# Altium project FMU3_REV_G.PrjPcb
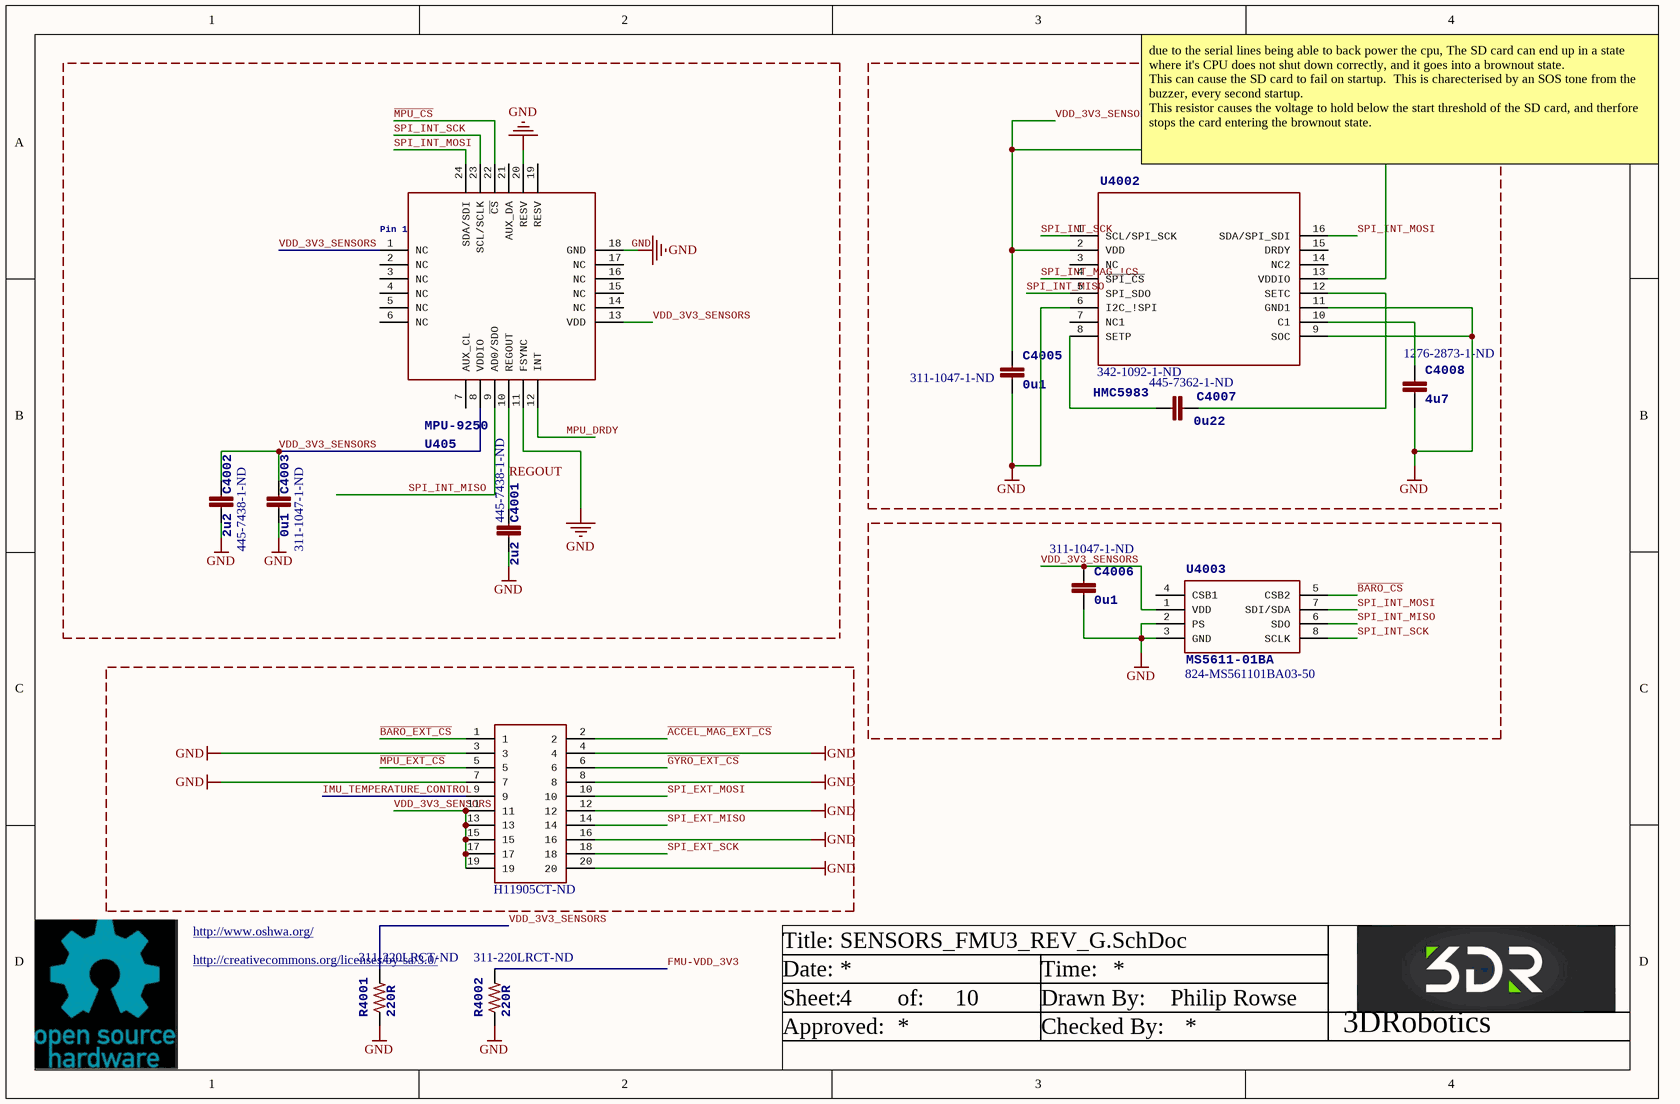
[diagram p0: SENSORS_FMU3_REV_G.SchDoc]
2 sheets, 25 parts. Net scope: global (net labels, ports and power ports of the same name join across sheets).
Board file: FMU3_REV_G.PcbDoc
Sheets:
  SENSORS_FMU3_REV_G.SchDoc
  PWM_PPM_FMU3_REV_G.SchDoc

## Sheet SENSORS_FMU3_REV_G.SchDoc: Pixhawk_mini_8L.sch
size A4; Date: 18/08/2014 1:53:16 PM; DrawnBy: Philip Rowse; SheetNumber: 4; SheetTotal: 10

### Parts
C4001  2u2  Supplier Part Number 1: 445-7438-1-ND  [0603-CAP]
C4002  2u2  Supplier Part Number 1: 445-7438-1-ND  [0603-CAP]
C4003  0u1  Supplier Part Number 1: 311-1047-1-ND  [0402-CAP]
C4005  0u1  Supplier Part Number 1: 311-1047-1-ND  [0402-CAP]
C4006  0u1  Supplier Part Number 1: 311-1047-1-ND  [0402-CAP]
C4007  0u22  Supplier Part Number 1: 445-7362-1-ND  [0402-CAP]
C4008  4u7  Supplier Part Number 1: 1276-2873-1-ND  [0805]
R4001  220R  Supplier Part Number 1: 311-220LRCT-ND  [0402-RES]
R4002  220R  Supplier Part Number 1: 311-220LRCT-ND  [0402-RES]
U405  MPU-9250  [MPU-9250]
U4002  HMC5983  Supplier Part Number 1: 342-1092-1-ND  [HMC5983-new]
U4003  MS5611-01BA  Supplier Part Number 1: 824-MS561101BA03-50  [MS5611-01BA]
U$2  Supplier Part Number 1: H11905CT-ND  [DF-40C-20DS]  (hidden comment: DF40C-20-DS)

### Nets
GND: C4001.P$2 C4002.P$2 C4003.P$2 C4005.P$2 C4006.P$2 C4008.2 R4001.P$1 R4002.P$1 U405.11(FSYNC) U405.18(GND) U405.20(RESV) U4002.6(I2C_!SPI) U4002.9(SOC) U4002.11(GND1) U4003.2(PS) U4003.3(GND) U$2.3 U$2.4 U$2.7 U$2.8 U$2.12 U$2.16 U$2.20
~{ACCEL_MAG_EXT_CS}: U$2.2
~{BARO_CS}: U4003.5(CSB2)
~{BARO_EXT_CS}: U$2.1
FMU-VDD_3V3: R4002.P$2
~{GYRO_EXT_CS}: U$2.6
IMU_TEMPERATURE_CONTROL: U$2.9
~{MPU_CS}: U405.22(~{CS})
~{MPU_EXT_CS}: U$2.5
MPU_DRDY: U405.12(INT)
REGOUT: C4001.P$1 U405.10(REGOUT)
SPI_EXT_MISO: U$2.14
SPI_EXT_MOSI: U$2.10
SPI_EXT_SCK: U$2.18
SPI_INT_MAG_!CS: U4002.4(~{SPI_CS})
SPI_INT_MISO: U405.9(AD0/SDO) U4002.5(SPI_SDO) U4003.6(SDO)
SPI_INT_MOSI: U405.24(SDA/SDI) U4002.16(SDA/SPI_SDI) U4003.7(SDI/SDA)
SPI_INT_SCK: U405.23(SCL/SCLK) U4002.1(SCL/SPI_SCK) U4003.8(SCLK)
VDD_3V3_SENSORS: C4002.P$1 C4003.P$1 C4005.P$1 C4006.P$1 R4001.P$2 U405.1(NC) U405.8(VDDIO) U405.13(VDD) U4002.2(VDD) U4002.13(VDDIO) U4003.1(VDD) U$2.11 U$2.13 U$2.15 U$2.17 U$2.19
NetC4007_P$1: C4007.P$1 U4002.12(SETC)
NetC4007_P$2: C4007.P$2 U4002.8(SETP)
NetC4008_1: C4008.1 U4002.10(C1)

Not connected (* = marked no-connect by the designer): U405 2(NC) 3(NC) 4(NC) 5(NC) 6(NC) 7(AUX_CL) 14(NC) 15(NC) 16(NC) 17(NC) 19(RESV) 21(AUX_DA); U4002 3(NC) 7(NC1) 14(NC2) 15(DRDY); U4003 4(CSB1)

### Notes on the sheet
- due to the serial lines being able to back power the cpu, The SD card can end up in a state where it's CPU does not shut down correctly, and it goes into a brownout state.
  This can cause the SD card to fail on startup.  This is charecterised by an SOS tone from the buzzer, every second startup.
  This resistor causes the voltage to hold below the start threshold of the SD card, and therfore stops the card entering the brownout state.
- http://www.oshwa.org/
- http://creativecommons.org/licenses/by-sa/3.0/
- Title:
- Date:
- Time:
- Sheet:
- Approved:
- of:
- Drawn By:
- Checked By:
- 3DRobotics

### Library data of the parts
C4001 C4002 = CAP0603: CAP CER 2.2UF 16V 10% X6S 0603; PARTNO: C1608X6S1C225K080AC; 3DR_PARTNO: ECM0619; Supplier 1: Digi-Key; Value: 2u2
C4003 C4006 = CAP0402: CAP CER 0.1UF 16V Y5V 0402; PARTNO: CC0402ZRY5V7BB104; 3DR_PARTNO: ECM0700; Supplier 1: Digi-Key; Value: 0u1
C4005 = CAP0402: CAP CER 0.1UF 16V Y5V 0402; 3DR_PARTNO: ECM0700; PARTNO: CC0402ZRY5V7BB104; Supplier 1: Digi-Key; Value: 0u1
C4007 = CAP0402: CAP CER 0.22UF 25V 10% X7R 0402; 3DR_PARTNO: ECM; PARTNO: C1005X6S1E224K050BC; Value: 0u22; Supplier 1: Digi-Key
C4008 = CAP0805: CAP CER 4.7UF 16V 10% X7R 0805; PARTNO: CL21B475KOFNNNE; 3DR_PARTNO: ECM0622; DATASHEET: http://www.digikey.com/product-detail/en/CL21B475KOFNNNE/1276-2873-2-ND/3888531; Supplier 1: Digi-Key; Value: 4u7
R4001 R4002 = RESISTOR0402-RES: RES 220 OHM 1/16W 1% 0402 SMD; 3DR_PARTNO: ECM0821; PARTNO: RC0402FR-07220RL; Supplier 1: Digi-Key; Value: 220R
U405 = MPU-6500: PARTNO: MPU-9250; Pin 1: Pin 1
U4002 = HMC5983: IC COMPASS 3 AXIS 16-LCC; 3DR_PARTNO: ECM0672; PARTNO: HMC5983; Supplier 1: Digi-Key
U4003 = MS5611-01BA: Board Mount Pressure Sensors; 3DR_PARTNO: ECM0835; Value: 10-1200mbar; DATASHEET: http://www.meas-spec.com/downloads/MS5611-01BA01.pdf; LINK: http://www.meas-spec.com/product/t_product.aspx?id=8503#; MFGPN: MS5611-01BA; PARTNO: MS5611-01BA; Supplier 1: Mouser
U$2 = DF40C-20-DS: CONN RCPT 20POS 0.4MM SMD GOLD; 3DR_PARTNO: ECM0517; PARTNO: DF40C(2.0)-20DS-0.4V(51); Supplier 1: Digi-Key

## Sheet PWM_PPM_FMU3_REV_G.SchDoc: Pixhawk_mini_8L.sch
size A4; Date: 18/08/2014 1:53:26 PM; DrawnBy: Philip Rowse; SheetNumber: 8; SheetTotal: 10
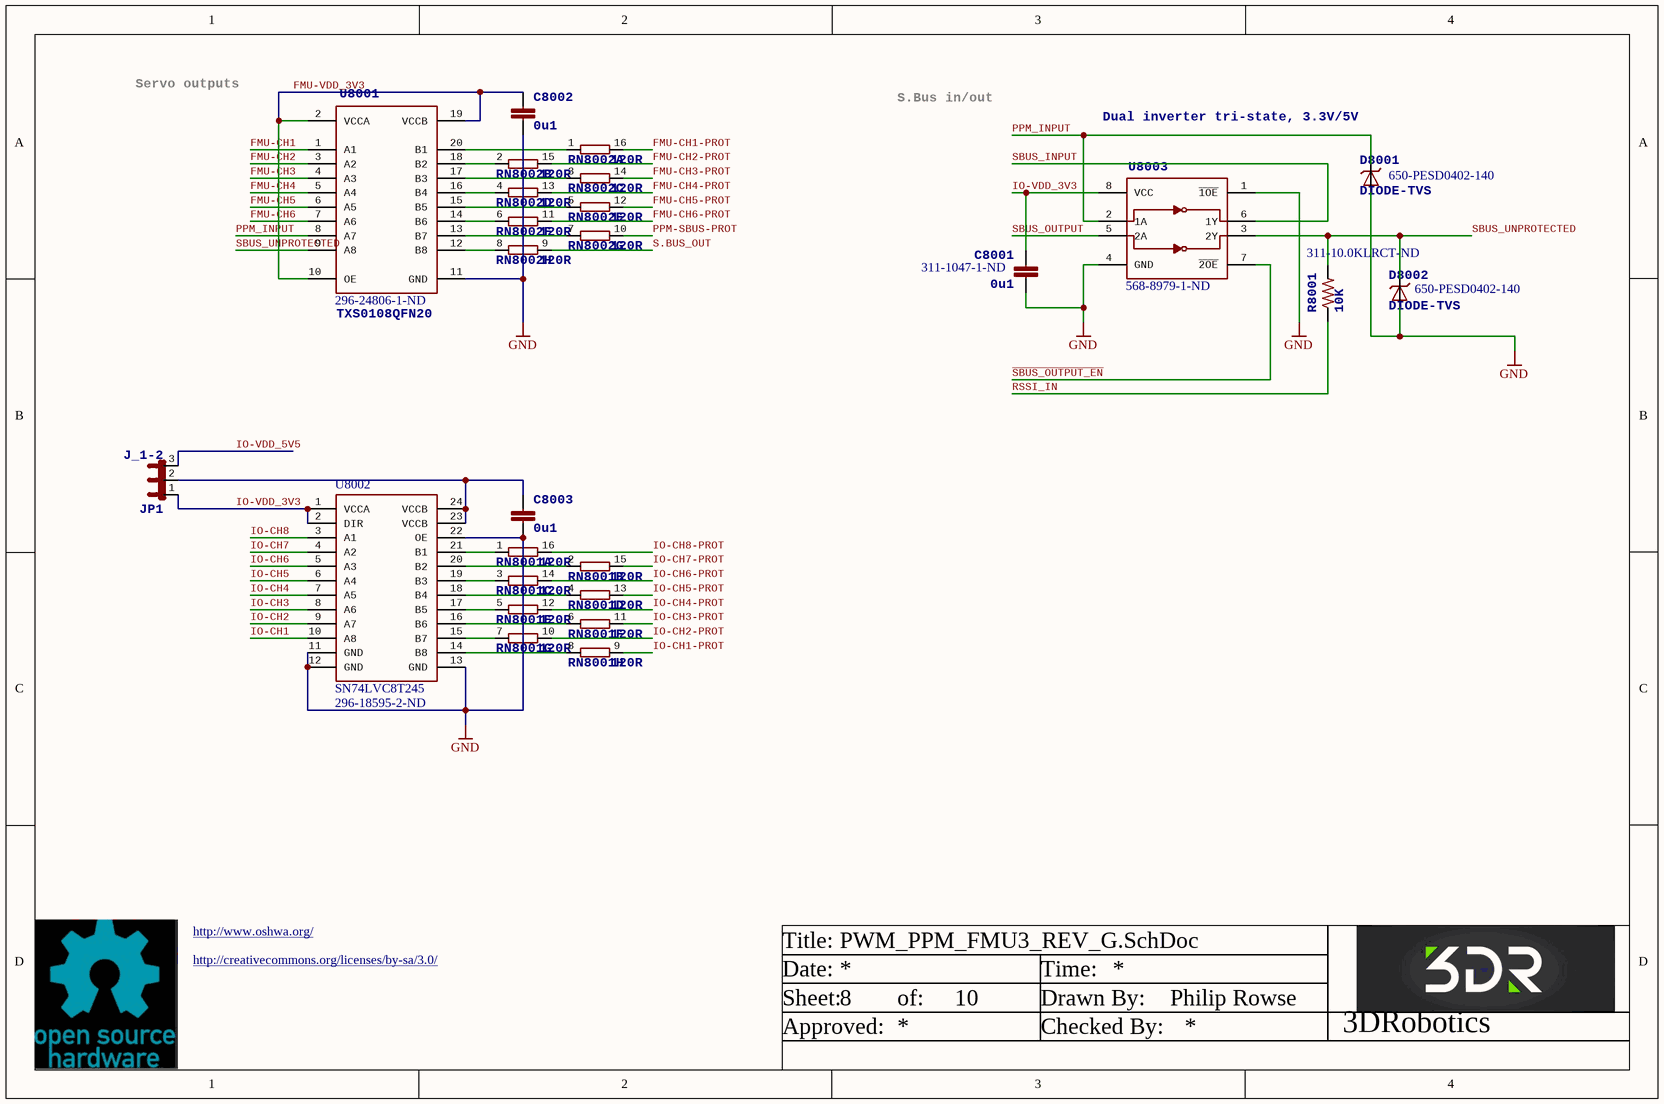
[diagram p1: PWM_PPM_FMU3_REV_G.SchDoc]

### Parts
C8001  0u1  Supplier Part Number 1: 311-1047-1-ND  [0402-CAP]
C8002  0u1  [0402-CAP]
C8003  0u1  [0402-CAP]
D8001  DIODE-TVS  Supplier Part Number 1: 650-PESD0402-140  [0402-TVS]
D8002  DIODE-TVS  Supplier Part Number 1: 650-PESD0402-140  [0402-TVS]
JP1  J_1-2  [SJ_3_NO_PLACE_1-2_short]
R8001  10K  Supplier Part Number 1: 311-10.0KLRCT-ND  [0402-RES]
RN8001  120R  [EXB2HV]  (parts A,B,C,D,E,F,G,H of 8)
RN8002  120R  [EXB2HV]  (parts A,B,C,D,E,F,G,H of 8)
U8001  TXS0108QFN20  Supplier Part Number 1: 296-24806-1-ND  [QFN20-RGY]
U8002  SN74LVC8T245  Supplier Part Number 1: 296-18595-2-ND  [QFN24-RGY]
U8003  Dual inverter tri-state, 3.3V/5V  Supplier Part Number 1: 568-8979-1-ND  [TSSOP8_SOT505-2]

### Nets
GND: C8001.P$2 C8002.P$2 C8003.P$2 D8001.A D8002.A U8001.11(GND) U8002.11(GND) U8002.12(GND) U8002.13(GND) U8002.22(OE) U8003.1(~{1OE}) U8003.4(GND)
FMU-CH1: U8001.1(A1)
FMU-CH1-PROT: RN8002.16
FMU-CH2: U8001.3(A2)
FMU-CH2-PROT: RN8002.15
FMU-CH3: U8001.4(A3)
FMU-CH3-PROT: RN8002.14
FMU-CH4: U8001.5(A4)
FMU-CH4-PROT: RN8002.13
FMU-CH5: U8001.6(A5)
FMU-CH5-PROT: RN8002.12
FMU-CH6: U8001.7(A6)
FMU-CH6-PROT: RN8002.11
FMU-VDD_3V3: C8002.P$1 U8001.2(VCCA) U8001.10(OE) U8001.19(VCCB)
IO-CH1: U8002.10(A8)
IO-CH1-PROT: RN8001.9
IO-CH2: U8002.9(A7)
IO-CH2-PROT: RN8001.10
IO-CH3: U8002.8(A6)
IO-CH3-PROT: RN8001.11
IO-CH4: U8002.7(A5)
IO-CH4-PROT: RN8001.12
IO-CH5: U8002.6(A4)
IO-CH5-PROT: RN8001.13
IO-CH6: U8002.5(A3)
IO-CH6-PROT: RN8001.14
IO-CH7: U8002.4(A2)
IO-CH7-PROT: RN8001.15
IO-CH8: U8002.3(A1)
IO-CH8-PROT: RN8001.16
IO-VDD_3V3: C8001.P$1 JP1.1 U8002.1(VCCA) U8002.2(DIR) U8003.8(VCC)
IO-VDD_5V5: JP1.3
PPM-SBUS-PROT: RN8002.10
PPM_INPUT: D8001.C U8001.8(A7) U8003.2(1A)
RSSI_IN: R8001.P$1
S.BUS_OUT: RN8002.9
~{SBUS_OUTPUT_EN}: U8003.7(~{2OE})
SBUS_INPUT: U8003.6(1Y)
SBUS_OUTPUT: U8003.5(2A)
SBUS_UNPROTECTED: D8002.C R8001.P$2 U8001.9(A8) U8003.3(2Y)
NetC8003_P$1: C8003.P$1 JP1.2 U8002.23(VCCB) U8002.24(VCCB)
NetRN8001_1: RN8001.1 U8002.21(B1)
NetRN8001_2: RN8001.2 U8002.20(B2)
NetRN8001_3: RN8001.3 U8002.19(B3)
NetRN8001_4: RN8001.4 U8002.18(B4)
NetRN8001_5: RN8001.5 U8002.17(B5)
NetRN8001_6: RN8001.6 U8002.16(B6)
NetRN8001_7: RN8001.7 U8002.15(B7)
NetRN8001_8: RN8001.8 U8002.14(B8)
NetRN8002_1: RN8002.1 U8001.20(B1)
NetRN8002_2: RN8002.2 U8001.18(B2)
NetRN8002_3: RN8002.3 U8001.17(B3)
NetRN8002_4: RN8002.4 U8001.16(B4)
NetRN8002_5: RN8002.5 U8001.15(B5)
NetRN8002_6: RN8002.6 U8001.14(B6)
NetRN8002_7: RN8002.7 U8001.13(B7)
NetRN8002_8: RN8002.8 U8001.12(B8)

### Notes on the sheet
- Servo outputs
- S.Bus in/out
- http://www.oshwa.org/
- http://creativecommons.org/licenses/by-sa/3.0/
- Title:
- Date:
- Time:
- Sheet:
- Approved:
- of:
- Drawn By:
- Checked By:
- 3DRobotics

### Library data of the parts
C8001-C8003 = CAP0402: as C4003 on sheet SENSORS_FMU3_REV_G; Supplier 1: Digi-Key; Value: 0u1
  C8002 C8003: Supplier Part Number 1: 311-1047-1-ND
D8001 D8002 = DIODE-TVS: TVS DIODE 14VWM 40VC 0402; 3DR_PARTNO: ECM0837; PARTNO: PESD0402-140; Value: 40v; Supplier 1: Mouser
JP1 = JUMPER-31-2
R8001 = RESISTOR0402-RES: RES 10K OHM 1/16W 1% 0402 SMD; PARTNO: RC0402FR-0710KL; 3DR_PARTNO: ECM0800; Supplier 1: Digi-Key; Value: 10K
RN8001 RN8002 = 8R-NEXB2HV-220R: RES ARRAY 120 OHM 8 RES 1506; PARTNO: EXB-2HV121JV; 3DR_PARTNO: ECM0266; OC_FARNELL: unknown; OC_NEWARK: unknown; Supplier 1: Digi-Key; Supplier Part Number 1: Y1121CT-ND; Value: 120R
U8001 = TXS0108QFN20: IC XLATR VOLT-LVL 8B BDIR 20QFN; 3DR_PARTNO: ECM0845; PARTNO: TXS0108ERGYR; Supplier 1: Digi-Key
U8003 = 74LVC2G240-TSSOP-8: IC INVERTER DUAL 4-INPUT 8TSSOP; 3DR_PARTNO: ECM0817; PARTNO: 74LVC2G240DP,125; Value: INV; Supplier 1: Digi-Key
U8002 = SN74LVC8T245: Supplier 1: Digi-Key

## Nets that join several sheets
GND: SENSORS_FMU3_REV_G (23 pins), PWM_PPM_FMU3_REV_G (12 pins)
FMU-VDD_3V3: SENSORS_FMU3_REV_G (R4002.P$2), PWM_PPM_FMU3_REV_G (C8002.P$1 U8001.2 U8001.10 U8001.19)

## Assembly variants
FMU3_REV_G: not fitted 3DR Logo 5v FMU-SWCLK FMU-SWDIO FMU-VDD_3V3 IO-SWCLK IO-SWDIO IO-VDD_3V3 M3_MOUNT1001 M3_MOUNT1003 M3_MOUNT1004 R1020 R1021 R7013 RX5 TX5 U$4